# EAGLE design powermax (EAGLE 7.2.0)
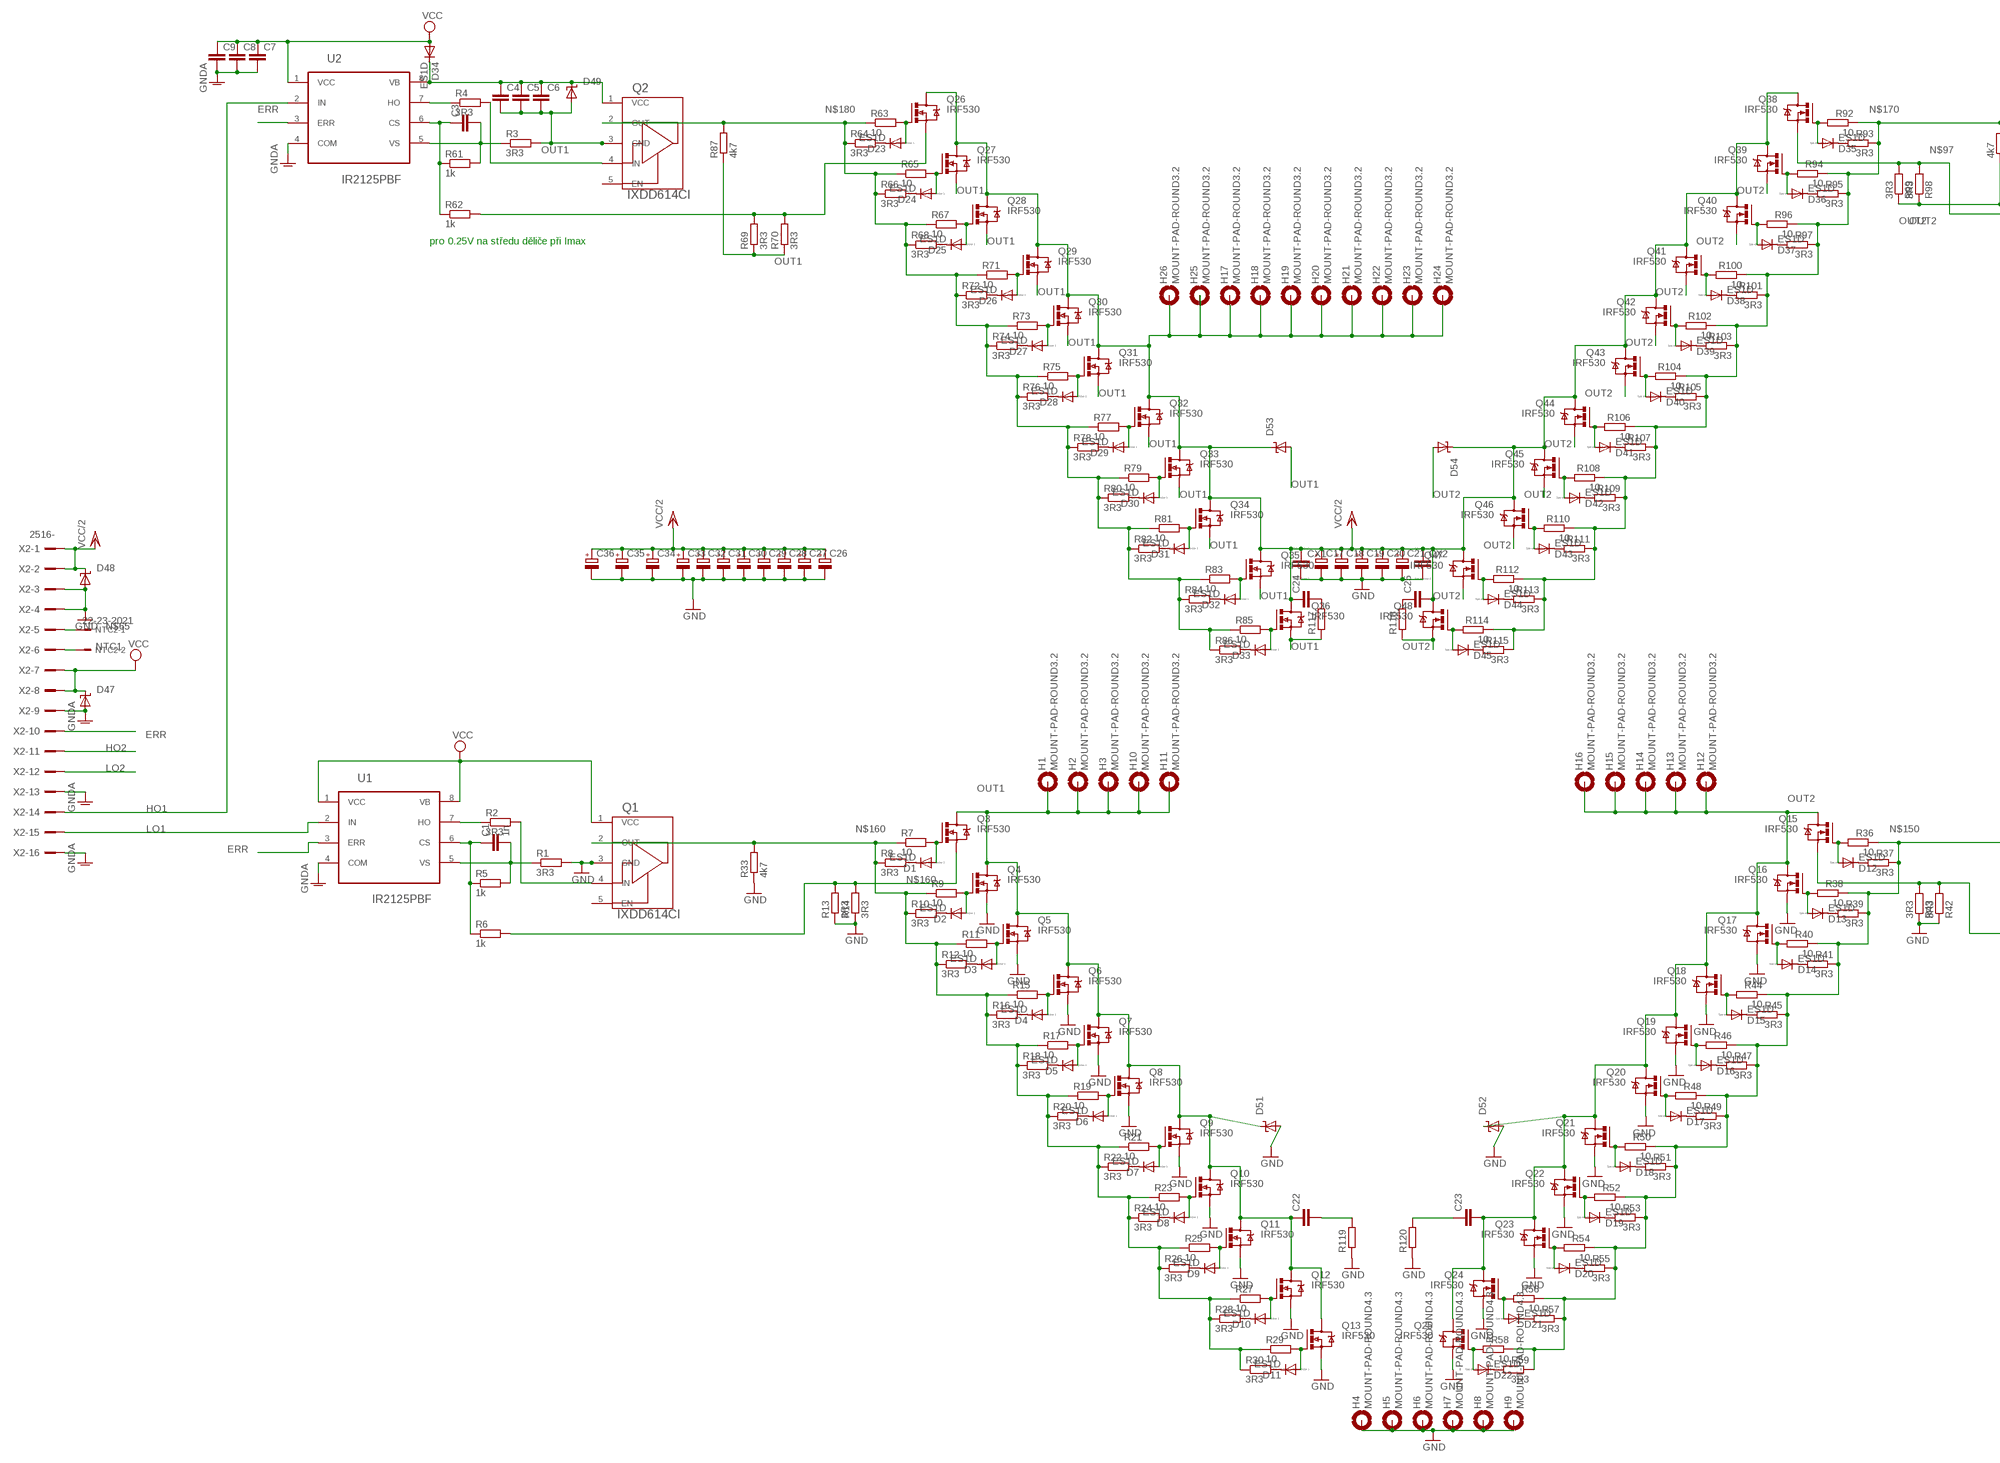
[diagram p0: schematic, sheet 1, part 1 of 2]
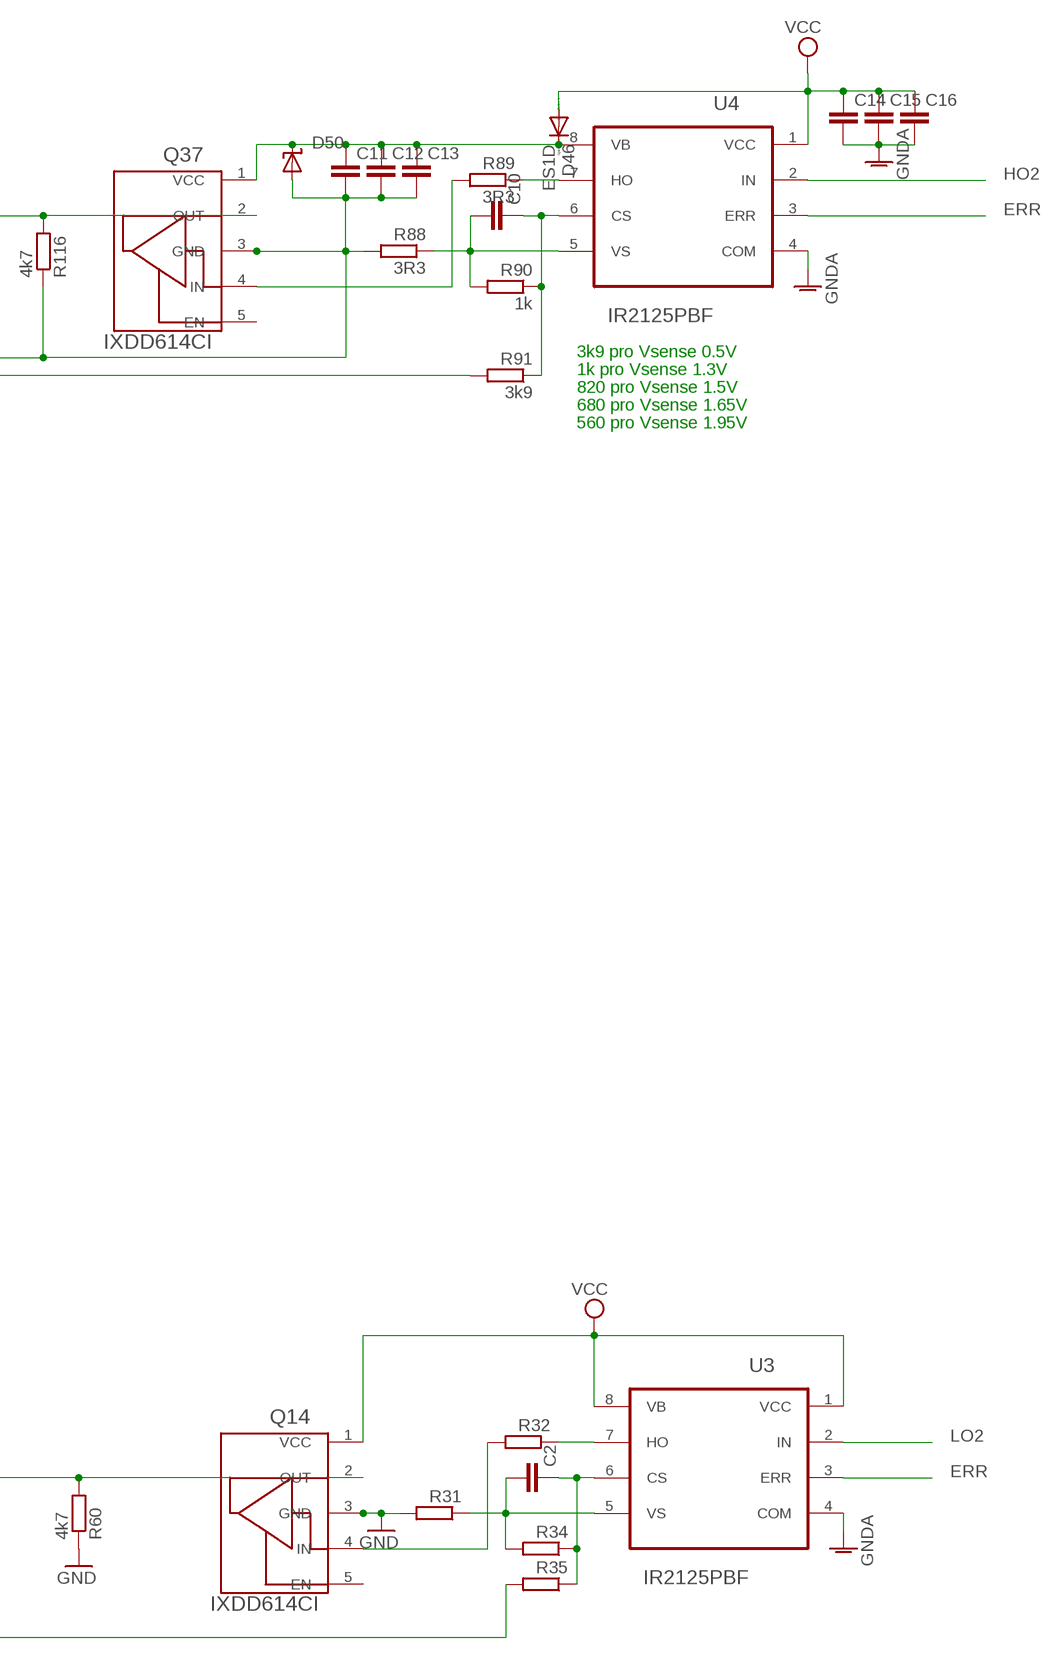
[diagram p1: schematic, sheet 1, part 2 of 2]

## Parts
C1  1n  C-EUC0805  [C0805]
C2  C-EUC0805  [C0805]
C3  C-EUC0805  [C0805]
C4  C-EUC1210  [C1210]
C5  C-EUC1210  [C1210]
C6  C-EUC1210  [C1210]
C7  C-EUC1210  [C1210]
C8  C-EUC1210  [C1210]
C9  C-EUC1210  [C1210]
C10  C-EUC0805  [C0805]
C11  C-EUC1210  [C1210]
C12  C-EUC1210  [C1210]
C13  C-EUC1210  [C1210]
C14  C-EUC1210  [C1210]
C15  C-EUC1210  [C1210]
C16  C-EUC1210  [C1210]
C17  CPOL-EUE10-35  [EB35D]
C18  CPOL-EUE10-35  [EB35D]
C19  CPOL-EUE10-35  [EB35D]
C20  CPOL-EUE10-35  [EB35D]
C21  CPOL-EUE10-35  [EB35D]
C22  C-EU225-113X268  [C225-113X268]
C23  C-EU225-113X268  [C225-113X268]
C24  C-EU225-113X268  [C225-113X268]
C25  C-EU225-113X268  [C225-113X268]
C26  CPOL-EUE7.5-18  [E7,5-18]
C27  CPOL-EUE7.5-18  [E7,5-18]
C28  CPOL-EUE7.5-18  [E7,5-18]
C29  CPOL-EUE7.5-18  [E7,5-18]
C30  CPOL-EUE7.5-18  [E7,5-18]
C31  CPOL-EUE7.5-18  [E7,5-18]
C32  CPOL-EUE7.5-18  [E7,5-18]
C33  CPOL-EUE7.5-18  [E7,5-18]
C34  CPOL-EUE7.5-18  [E7,5-18]
C35  CPOL-EUE7.5-18  [E7,5-18]
C36  CPOL-EUE7.5-18  [E7,5-18]
CX1  CXXC27B11  [XC27B11]
CX2  CXXC27B11  [XC27B11]
D1  ES1D  PMLL4150  [SOD80C]
D2  ES1D  PMLL4150  [SOD80C]
D3  ES1D  PMLL4150  [SOD80C]
D4  ES1D  PMLL4150  [SOD80C]
D5  ES1D  PMLL4150  [SOD80C]
D6  ES1D  PMLL4150  [SOD80C]
D7  ES1D  PMLL4150  [SOD80C]
D8  ES1D  PMLL4150  [SOD80C]
D9  ES1D  PMLL4150  [SOD80C]
D10  ES1D  PMLL4150  [SOD80C]
D11  ES1D  PMLL4150  [SOD80C]
D12  ES1D  PMLL4150  [SOD80C]
D13  ES1D  PMLL4150  [SOD80C]
D14  ES1D  PMLL4150  [SOD80C]
D15  ES1D  PMLL4150  [SOD80C]
D16  ES1D  PMLL4150  [SOD80C]
D17  ES1D  PMLL4150  [SOD80C]
D18  ES1D  PMLL4150  [SOD80C]
D19  ES1D  PMLL4150  [SOD80C]
D20  ES1D  PMLL4150  [SOD80C]
D21  ES1D  PMLL4150  [SOD80C]
D22  ES1D  PMLL4150  [SOD80C]
D23  ES1D  PMLL4150  [SOD80C]
D24  ES1D  PMLL4150  [SOD80C]
D25  ES1D  PMLL4150  [SOD80C]
D26  ES1D  PMLL4150  [SOD80C]
D27  ES1D  PMLL4150  [SOD80C]
D28  ES1D  PMLL4150  [SOD80C]
D29  ES1D  PMLL4150  [SOD80C]
D30  ES1D  PMLL4150  [SOD80C]
D31  ES1D  PMLL4150  [SOD80C]
D32  ES1D  PMLL4150  [SOD80C]
D33  ES1D  PMLL4150  [SOD80C]
D34  ES1D  PMLL4150  [SOD80C]
D35  ES1D  PMLL4150  [SOD80C]
D36  ES1D  PMLL4150  [SOD80C]
D37  ES1D  PMLL4150  [SOD80C]
D38  ES1D  PMLL4150  [SOD80C]
D39  ES1D  PMLL4150  [SOD80C]
D40  ES1D  PMLL4150  [SOD80C]
D41  ES1D  PMLL4150  [SOD80C]
D42  ES1D  PMLL4150  [SOD80C]
D43  ES1D  PMLL4150  [SOD80C]
D44  ES1D  PMLL4150  [SOD80C]
D45  ES1D  PMLL4150  [SOD80C]
D46  ES1D  PMLL4150  [SOD80C]
D47  SUPPRESSOR-SMBJ  [SMBJ]
D48  SUPPRESSOR-SMBJ  [SMBJ]
D49  SUPPRESSOR-SMBJ  [SMBJ]
D50  SUPPRESSOR-SMBJ  [SMBJ]
D51  SUPPRESSOR-SMBJ  [SMBJ]
D52  SUPPRESSOR-SMBJ  [SMBJ]
D53  SUPPRESSOR-SMBJ  [SMBJ]
D54  SUPPRESSOR-SMBJ  [SMBJ]
H1  MOUNT-PAD-ROUND3.2  [3,2-PAD]
H2  MOUNT-PAD-ROUND3.2  [3,2-PAD]
H3  MOUNT-PAD-ROUND3.2  [3,2-PAD]
H4  MOUNT-PAD-ROUND4.3  [4,3-PAD]
H5  MOUNT-PAD-ROUND4.3  [4,3-PAD]
H6  MOUNT-PAD-ROUND4.3  [4,3-PAD]
H7  MOUNT-PAD-ROUND4.3  [4,3-PAD]
H8  MOUNT-PAD-ROUND4.3  [4,3-PAD]
H9  MOUNT-PAD-ROUND4.3  [4,3-PAD]
H10  MOUNT-PAD-ROUND3.2  [3,2-PAD]
H11  MOUNT-PAD-ROUND3.2  [3,2-PAD]
H12  MOUNT-PAD-ROUND3.2  [3,2-PAD]
H13  MOUNT-PAD-ROUND3.2  [3,2-PAD]
H14  MOUNT-PAD-ROUND3.2  [3,2-PAD]
H15  MOUNT-PAD-ROUND3.2  [3,2-PAD]
H16  MOUNT-PAD-ROUND3.2  [3,2-PAD]
H17  MOUNT-PAD-ROUND3.2  [3,2-PAD]
H18  MOUNT-PAD-ROUND3.2  [3,2-PAD]
H19  MOUNT-PAD-ROUND3.2  [3,2-PAD]
H20  MOUNT-PAD-ROUND3.2  [3,2-PAD]
H21  MOUNT-PAD-ROUND3.2  [3,2-PAD]
H22  MOUNT-PAD-ROUND3.2  [3,2-PAD]
H23  MOUNT-PAD-ROUND3.2  [3,2-PAD]
H24  MOUNT-PAD-ROUND3.2  [3,2-PAD]
H25  MOUNT-PAD-ROUND3.2  [3,2-PAD]
H26  MOUNT-PAD-ROUND3.2  [3,2-PAD]
NTC2  22-23-2021  [22-23-2021]
Q1  IXDD614CI  [TO-220-5]
Q2  IXDD614CI  [TO-220-5]
Q3  IRF530  [TO220BV]
Q4  IRF530  [TO220BV]
Q5  IRF530  [TO220BV]
Q6  IRF530  [TO220BV]
Q7  IRF530  [TO220BV]
Q8  IRF530  [TO220BV]
Q9  IRF530  [TO220BV]
Q10  IRF530  [TO220BV]
Q11  IRF530  [TO220BV]
Q12  IRF530  [TO220BV]
Q13  IRF530  [TO220BV]
Q14  IXDD614CI  [TO-220-5]
Q15  IRF530  [TO220BV]
Q16  IRF530  [TO220BV]
Q17  IRF530  [TO220BV]
Q18  IRF530  [TO220BV]
Q19  IRF530  [TO220BV]
Q20  IRF530  [TO220BV]
Q21  IRF530  [TO220BV]
Q22  IRF530  [TO220BV]
Q23  IRF530  [TO220BV]
Q24  IRF530  [TO220BV]
Q25  IRF530  [TO220BV]
Q26  IRF530  [TO220BV]
Q27  IRF530  [TO220BV]
Q28  IRF530  [TO220BV]
Q29  IRF530  [TO220BV]
Q30  IRF530  [TO220BV]
Q31  IRF530  [TO220BV]
Q32  IRF530  [TO220BV]
Q33  IRF530  [TO220BV]
Q34  IRF530  [TO220BV]
Q35  IRF530  [TO220BV]
Q36  IRF530  [TO220BV]
Q37  IXDD614CI  [TO-220-5]
Q38  IRF530  [TO220BV]
Q39  IRF530  [TO220BV]
Q40  IRF530  [TO220BV]
Q41  IRF530  [TO220BV]
Q42  IRF530  [TO220BV]
Q43  IRF530  [TO220BV]
Q44  IRF530  [TO220BV]
Q45  IRF530  [TO220BV]
Q46  IRF530  [TO220BV]
Q47  IRF530  [TO220BV]
Q48  IRF530  [TO220BV]
R1  3R3  R-EU_R0805  [R0805]
R2  3R3  R-EU_R0805  [R0805]
R3  3R3  R-EU_R0805  [R0805]
R4  3R3  R-EU_R0805  [R0805]
R5  1k  R-EU_R0805  [R0805]
R6  1k  R-EU_R0805  [R0805]
R7  10  R-EU_R0805  [R0805]
R8  3R3  R-EU_R0805  [R0805]
R9  10  R-EU_R0805  [R0805]
R10  3R3  R-EU_R0805  [R0805]
R11  10  R-EU_R0805  [R0805]
R12  3R3  R-EU_R0805  [R0805]
R13  3R3  R-EU_R0805  [R0805]
R14  3R3  R-EU_R0805  [R0805]
R15  10  R-EU_R0805  [R0805]
R16  3R3  R-EU_R0805  [R0805]
R17  10  R-EU_R0805  [R0805]
R18  3R3  R-EU_R0805  [R0805]
R19  10  R-EU_R0805  [R0805]
R20  3R3  R-EU_R0805  [R0805]
R21  10  R-EU_R0805  [R0805]
R22  3R3  R-EU_R0805  [R0805]
R23  10  R-EU_R0805  [R0805]
R24  3R3  R-EU_R0805  [R0805]
R25  10  R-EU_R0805  [R0805]
R26  3R3  R-EU_R0805  [R0805]
R27  10  R-EU_R0805  [R0805]
R28  3R3  R-EU_R0805  [R0805]
R29  10  R-EU_R0805  [R0805]
R30  3R3  R-EU_R0805  [R0805]
R31  R-EU_R0805  [R0805]
R32  R-EU_R0805  [R0805]
R33  4k7  R-EU_R0805  [R0805]
R34  R-EU_R0805  [R0805]
R35  R-EU_R0805  [R0805]
R36  10  R-EU_R0805  [R0805]
R37  3R3  R-EU_R0805  [R0805]
R38  10  R-EU_R0805  [R0805]
R39  3R3  R-EU_R0805  [R0805]
R40  10  R-EU_R0805  [R0805]
R41  3R3  R-EU_R0805  [R0805]
R42  3R3  R-EU_R0805  [R0805]
R43  3R3  R-EU_R0805  [R0805]
R44  10  R-EU_R0805  [R0805]
R45  3R3  R-EU_R0805  [R0805]
R46  10  R-EU_R0805  [R0805]
R47  3R3  R-EU_R0805  [R0805]
R48  10  R-EU_R0805  [R0805]
R49  3R3  R-EU_R0805  [R0805]
R50  10  R-EU_R0805  [R0805]
R51  3R3  R-EU_R0805  [R0805]
R52  10  R-EU_R0805  [R0805]
R53  3R3  R-EU_R0805  [R0805]
R54  10  R-EU_R0805  [R0805]
R55  3R3  R-EU_R0805  [R0805]
R56  10  R-EU_R0805  [R0805]
R57  3R3  R-EU_R0805  [R0805]
R58  10  R-EU_R0805  [R0805]
R59  3R3  R-EU_R0805  [R0805]
R60  4k7  R-EU_R0805  [R0805]
R61  1k  R-EU_R0805  [R0805]
R62  1k  R-EU_R0805  [R0805]
R63  10  R-EU_R0805  [R0805]
R64  3R3  R-EU_R0805  [R0805]
R65  10  R-EU_R0805  [R0805]
R66  3R3  R-EU_R0805  [R0805]
R67  10  R-EU_R0805  [R0805]
R68  3R3  R-EU_R0805  [R0805]
R69  3R3  R-EU_R0805  [R0805]
R70  3R3  R-EU_R0805  [R0805]
R71  10  R-EU_R0805  [R0805]
R72  3R3  R-EU_R0805  [R0805]
R73  10  R-EU_R0805  [R0805]
R74  3R3  R-EU_R0805  [R0805]
R75  10  R-EU_R0805  [R0805]
R76  3R3  R-EU_R0805  [R0805]
R77  10  R-EU_R0805  [R0805]
R78  3R3  R-EU_R0805  [R0805]
R79  10  R-EU_R0805  [R0805]
R80  3R3  R-EU_R0805  [R0805]
R81  10  R-EU_R0805  [R0805]
R82  3R3  R-EU_R0805  [R0805]
R83  10  R-EU_R0805  [R0805]
R84  3R3  R-EU_R0805  [R0805]
R85  10  R-EU_R0805  [R0805]
R86  3R3  R-EU_R0805  [R0805]
R87  4k7  R-EU_R0805  [R0805]
R88  3R3  R-EU_R0805  [R0805]
R89  3R3  R-EU_R0805  [R0805]
R90  1k  R-EU_R0805  [R0805]
R91  3k9  R-EU_R0805  [R0805]
R92  10  R-EU_R0805  [R0805]
R93  3R3  R-EU_R0805  [R0805]
R94  10  R-EU_R0805  [R0805]
R95  3R3  R-EU_R0805  [R0805]
R96  10  R-EU_R0805  [R0805]
R97  3R3  R-EU_R0805  [R0805]
R98  3R3  R-EU_R0805  [R0805]
R99  3R3  R-EU_R0805  [R0805]
R100  10  R-EU_R0805  [R0805]
R101  3R3  R-EU_R0805  [R0805]
R102  10  R-EU_R0805  [R0805]
R103  3R3  R-EU_R0805  [R0805]
R104  10  R-EU_R0805  [R0805]
R105  3R3  R-EU_R0805  [R0805]
R106  10  R-EU_R0805  [R0805]
R107  3R3  R-EU_R0805  [R0805]
R108  10  R-EU_R0805  [R0805]
R109  3R3  R-EU_R0805  [R0805]
R110  10  R-EU_R0805  [R0805]
R111  3R3  R-EU_R0805  [R0805]
R112  10  R-EU_R0805  [R0805]
R113  3R3  R-EU_R0805  [R0805]
R114  10  R-EU_R0805  [R0805]
R115  3R3  R-EU_R0805  [R0805]
R116  4k7  R-EU_R0805  [R0805]
R117  R-EU_0411/15  [0411/15]
R118  R-EU_0411/15  [0411/15]
R119  R-EU_0411/15  [0411/15]
R120  R-EU_0411/15  [0411/15]
U1  IR2125PBF  [DIP254P762X533-8]
U2  IR2125PBF  [DIP254P762X533-8]
U3  IR2125PBF  [DIP254P762X533-8]
U4  IR2125PBF  [DIP254P762X533-8]
X2  2516-  [PAK100/2500-16]

## Nets
ERR: U1.3(ERR) U2.3(ERR) U3.3(ERR) U4.3(ERR) X2.10
GND: C17.- C18.- C19.- C20.- C21.- C26.- C27.- C28.- C29.- C30.- C31.- C32.- C33.- C34.- C35.- C36.- CX1.2 CX2.2 D48.A D51.A D52.A H4.B4,3(MOUNT) H5.B4,3(MOUNT) H6.B4,3(MOUNT) H7.B4,3(MOUNT) H8.B4,3(MOUNT) H9.B4,3(MOUNT) Q1.3(GND) Q4.S Q5.S Q6.S Q7.S Q8.S Q9.S Q10.S Q11.S Q12.S Q13.S Q14.3(GND) Q16.S Q17.S Q18.S Q19.S Q20.S Q21.S Q22.S Q23.S Q24.S Q25.S R1.2 R13.1 R14.1 R31.2 R33.1 R42.1 R43.1 R60.1 R119.1 R120.1 X2.3 X2.4
GNDA: C7.2 C8.2 C9.2 C14.2 C15.2 C16.2 D47.A U1.4(COM) U2.4(COM) U3.4(COM) U4.4(COM) X2.9 X2.13 X2.16
HO1: U2.2(IN) X2.14
HO2: U4.2(IN) X2.11
LO1: U1.2(IN) X2.15
LO2: U3.2(IN) X2.12
N$1: C1.2 R1.1 R5.2 U1.5(VS)
N$2: Q1.4(IN) R2.2
N$3: R2.1 U1.7(HO)
N$4: C2.2 R31.1 R34.2 U3.5(VS)
N$5: D2.A Q4.G R9.2
N$6: C1.1 R5.1 R6.1 U1.6(CS)
N$7: D1.A Q3.G R7.2
N$8: D1.C R8.2
N$9: D2.C R10.2
N$10: Q14.4(IN) R32.2
N$11: R32.1 U3.7(HO)
N$12: C4.1 C5.1 C6.1 D34.C D49.C Q2.1(VCC) U2.8(VB)
N$13: D3.A Q5.G R11.2
N$14: D3.C R12.2
N$15: C2.1 R34.1 R35.1 U3.6(CS)
N$16: Q3.S R6.2 R13.2 R14.2
N$17: D12.A Q15.G R36.2
N$18: D12.C R37.2
N$19: D4.A Q6.G R15.2
N$20: D4.C R16.2
N$21: D5.A Q7.G R17.2
N$22: D5.C R18.2
N$23: D13.A Q16.G R38.2
N$24: D6.A Q8.G R19.2
N$25: D6.C R20.2
N$26: D13.C R39.2
N$27: D7.A Q9.G R21.2
N$28: D7.C R22.2
N$29: D8.A Q10.G R23.2
N$30: D8.C R24.2
N$32: D9.A Q11.G R25.2
N$33: D9.C R26.2
N$34: D14.A Q17.G R40.2
N$35: D10.A Q12.G R27.2
N$36: D10.C R28.2
N$37: D11.A Q13.G R29.2
N$38: D11.C R30.2
N$39: D14.C R41.2
N$40: Q15.S R35.2 R42.2 R43.2
N$41: D15.A Q18.G R44.2
N$42: D15.C R45.2
N$43: D16.A Q19.G R46.2
N$44: D16.C R47.2
N$45: D17.A Q20.G R48.2
N$46: D17.C R49.2
N$47: D18.A Q21.G R50.2
N$48: D18.C R51.2
N$49: D19.A Q22.G R52.2
N$50: D19.C R53.2
N$51: D20.A Q23.G R54.2
N$52: D20.C R55.2
N$53: D21.A Q24.G R56.2
N$54: D21.C R57.2
N$55: D22.A Q25.G R58.2
N$56: D22.C R59.2
N$57: C3.2 R3.1 R61.2 U2.5(VS)
N$58: Q2.4(IN) R4.2
N$59: R4.1 U2.7(HO)
N$60: C3.1 R61.1 R62.1 U2.6(CS)
N$61: D23.A Q26.G R63.2
N$62: D23.C R64.2
N$63: D24.A Q27.G R65.2
N$64: D24.C R66.2
N$65: NTC2.1 X2.5
N$66: D25.A Q28.G R67.2
N$67: D25.C R68.2
N$68: Q26.S R62.2 R69.2 R70.2
N$69: D26.A Q29.G R71.2
N$70: D26.C R72.2
N$71: D27.A Q30.G R73.2
N$72: D27.C R74.2
N$73: D28.A Q31.G R75.2
N$74: D28.C R76.2
N$75: D29.A Q32.G R77.2
N$76: D29.C R78.2
N$77: D30.A Q33.G R79.2
N$78: D30.C R80.2
N$79: D31.A Q34.G R81.2
N$80: D31.C R82.2
N$81: D32.A Q35.G R83.2
N$82: D32.C R84.2
N$83: D33.A Q36.G R85.2
N$84: D33.C R86.2
N$86: C10.2 R88.1 R90.2 U4.5(VS)
N$87: Q37.4(IN) R89.2
N$88: R89.1 U4.7(HO)
N$89: C10.1 R90.1 R91.1 U4.6(CS)
N$90: D35.A Q38.G R92.2
N$91: D35.C R93.2
N$92: D36.A Q39.G R94.2
N$93: D36.C R95.2
N$95: D37.A Q40.G R96.2
N$96: D37.C R97.2
N$97: Q38.S R91.2 R98.2 R99.2
N$98: D38.A Q41.G R100.2
N$99: D38.C R101.2
N$100: D39.A Q42.G R102.2
N$101: D39.C R103.2
N$102: D40.A Q43.G R104.2
N$103: D40.C R105.2
N$104: D41.A Q44.G R106.2
N$105: D41.C R107.2
N$106: D42.A Q45.G R108.2
N$107: D42.C R109.2
N$108: D43.A Q46.G R110.2
N$109: D43.C R111.2
N$110: D44.A Q47.G R112.2
N$111: D44.C R113.2
N$112: D45.A Q48.G R114.2
N$113: D45.C R115.2
N$115: C11.1 C12.1 C13.1 D46.C D50.C Q37.1(VCC) U4.8(VB)
N$118: C24.2 R117.2
N$119: C25.1 R118.2
N$120: C22.2 R119.2
N$121: C23.1 R120.2
N$150: Q14.2(OUT) R36.1 R37.1 R38.1 R39.1 R40.1 R41.1 R44.1 R45.1 R46.1 R47.1 R48.1 R49.1 R50.1 R51.1 R52.1 R53.1 R54.1 R55.1 R56.1 R57.1 R58.1 R59.1 R60.2
N$160: Q1.2(OUT) R7.1 R8.1 R9.1 R10.1 R11.1 R12.1 R15.1 R16.1 R17.1 R18.1 R19.1 R20.1 R21.1 R22.1 R23.1 R24.1 R25.1 R26.1 R27.1 R28.1 R29.1 R30.1 R33.2
N$170: Q37.2(OUT) R92.1 R93.1 R94.1 R95.1 R96.1 R97.1 R100.1 R101.1 R102.1 R103.1 R104.1 R105.1 R106.1 R107.1 R108.1 R109.1 R110.1 R111.1 R112.1 R113.1 R114.1 R115.1 R116.2
N$180: Q2.2(OUT) R63.1 R64.1 R65.1 R66.1 R67.1 R68.1 R71.1 R72.1 R73.1 R74.1 R75.1 R76.1 R77.1 R78.1 R79.1 R80.1 R81.1 R82.1 R83.1 R84.1 R85.1 R86.1 R87.2
NTC1: NTC2.2 X2.6
OUT1: C4.2 C5.2 C6.2 C22.1 D49.A D51.C D53.A H1.B3,2(MOUNT) H2.B3,2(MOUNT) H3.B3,2(MOUNT) H10.B3,2(MOUNT) H11.B3,2(MOUNT) Q2.3(GND) Q3.D Q4.D Q5.D Q6.D Q7.D Q8.D Q9.D Q10.D Q11.D Q12.D Q13.D Q27.S Q28.S Q29.S Q30.S Q31.S Q32.S Q33.S Q34.S Q35.S Q36.S R3.2 R69.1 R70.1 R87.1 R117.1
OUT2: C11.2 C12.2 C13.2 C23.2 D50.A D52.C D54.A H12.B3,2(MOUNT) H13.B3,2(MOUNT) H14.B3,2(MOUNT) H15.B3,2(MOUNT) H16.B3,2(MOUNT) Q15.D Q16.D Q17.D Q18.D Q19.D Q20.D Q21.D Q22.D Q23.D Q24.D Q25.D Q37.3(GND) Q39.S Q40.S Q41.S Q42.S Q43.S Q44.S Q45.S Q46.S Q47.S Q48.S R88.2 R98.1 R99.1 R116.1 R118.1
VCC: C7.1 C8.1 C9.1 C14.1 C15.1 C16.1 D34.A D46.A D47.C Q1.1(VCC) Q14.1(VCC) U1.1(VCC) U1.8(VB) U2.1(VCC) U3.1(VCC) U3.8(VB) U4.1(VCC) X2.7 X2.8
VCC/2: C17.+ C18.+ C19.+ C20.+ C21.+ C24.1 C25.2 C26.+ C27.+ C28.+ C29.+ C30.+ C31.+ C32.+ C33.+ C34.+ C35.+ C36.+ CX1.1 CX2.1 D48.C D53.C D54.C H17.B3,2(MOUNT) H18.B3,2(MOUNT) H19.B3,2(MOUNT) H20.B3,2(MOUNT) H21.B3,2(MOUNT) H22.B3,2(MOUNT) H23.B3,2(MOUNT) H24.B3,2(MOUNT) H26.B3,2(MOUNT) Q26.D Q27.D Q28.D Q29.D Q30.D Q31.D Q32.D Q33.D Q34.D Q35.D Q36.D Q38.D Q39.D Q40.D Q41.D Q42.D Q43.D Q44.D Q45.D Q46.D Q47.D Q48.D X2.1 X2.2
Unconnected: H25.B3,2(MOUNT) Q1.5(EN) Q2.5(EN) Q14.5(EN) Q37.5(EN)

## Notes on the sheet
- 3k9 pro Vsense 0.5V
- 1k pro Vsense 1.3V
- 820 pro Vsense 1.5V
- 680 pro Vsense 1.65V
- pro 0.25V na středu děliče při Imax | 560 pro Vsense 1.95V

## Library data of the parts
C1-C16 C22-C25 = resistor:C-EU: CAPACITOR, European symbol
C17-C21 C26-C36 = resistor:CPOL-EU: POLARIZED CAPACITOR, European symbol
CX1 CX2 = resistor:CX: X CAPACITOR for power line
D1-D46 = diode:PMLL4150: DIODE high speed
D47-D54 = diode:SUPPRESSOR-: Suppressor diode
H1-H26 = holes:MOUNT-PAD-ROUND: MOUNTING PAD, round
NTC2 = con-molex:22-23-2021: .100" (2.54mm) Center Header - 2 Pin; MF: MOLEX; MPN: 22-23-2021; OC_FARNELL: 1462926; OC_NEWARK: 25C3832
Q1 Q2 Q14 Q37 = IXDD614CI:IXDD614CI: MOSFET N-CH 14A LO SIDE TO-220-5; AVAILABILITY: Unavailable; DESCRIPTION: Low-Side Gate Driver IC Non-Inverting TO-220-5; MF: IXYS Integrated; MP: IXDD614CI; PACKAGE: TO-220 IXYS; PRICE: None
Q3-Q13 Q15-Q36 Q38-Q48 = transistor-power:IRF530: HEXFET Power MOSFET
R1-R120 = resistor:R-EU_: RESISTOR, European symbol
U1-U4 = ir21xx:IR2125PBF: SINGLE CHANNEL DRIVER; MPN: IR2125PBF; OC_FARNELL: 9101721; OC_NEWARK: 19K8423; PACKAGE: PDIP; SUPPLIER: INTERNATIONAL RECTIFIER
X2 = con-3m:2516-: 3M (TM) Pak 100 4-Wall Header Source: 3M; OC_FARNELL: unknown; OC_NEWARK: unknown

## Board
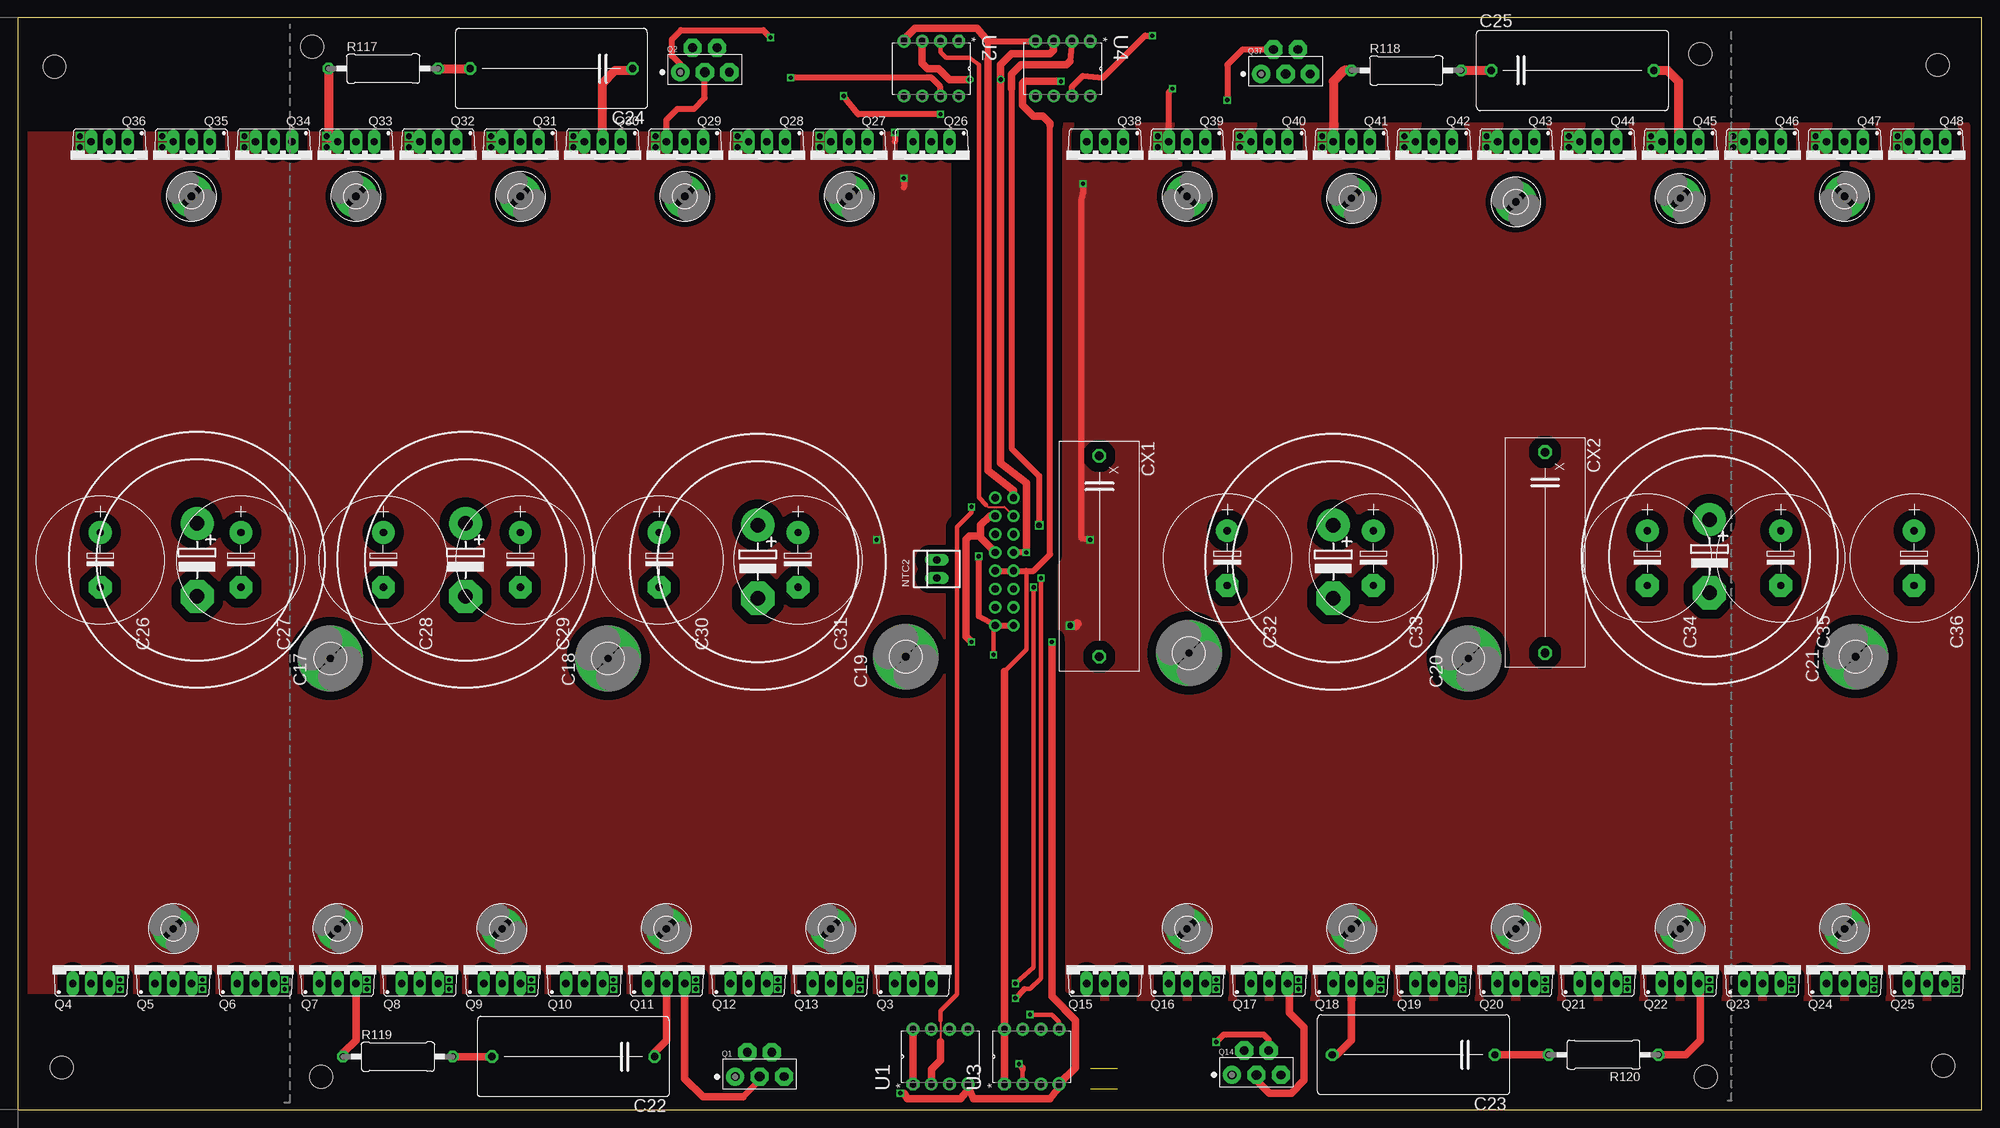
[diagram p2: board, top side]
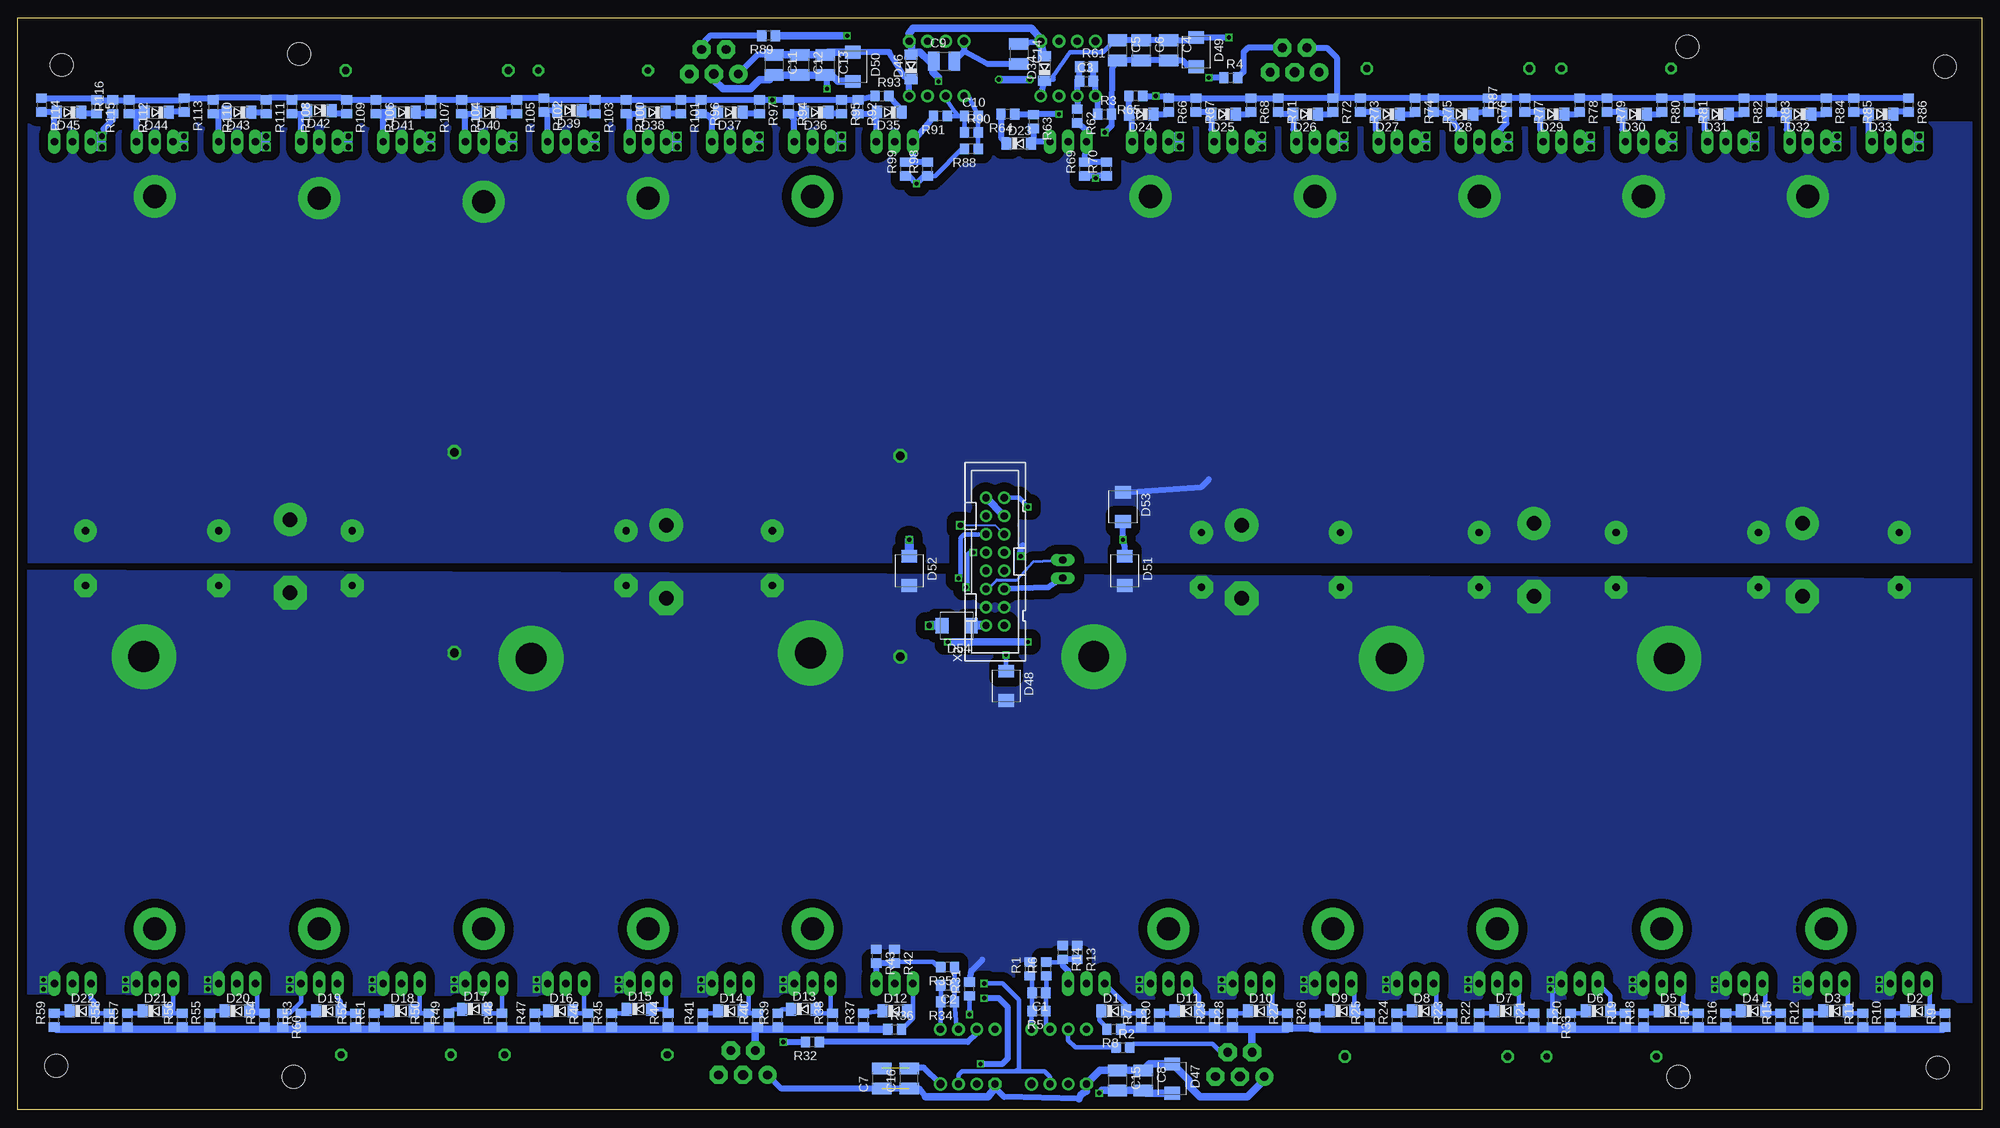
[diagram p3: board, bottom side, seen from below]

Size 273.03 x 151.82 mm. Coordinates in mm from the lower left corner, seen from the top.
Outline: 0,0 273.03,0 273.03,151.82 0,151.82 0,0
Copper layers (1*16): Top 0.035mm / dielectric 1.5mm / Bottom 0.035mm
Design rules "2 vrstvy trida 6 *": minimum track width 0.15mm, minimum drill 0.3mm, track to track 0.15mm, track to pad 0.15mm, pad to pad 0.15mm, via to via 0.15mm, smd to smd 0.15mm, copper to edge 1mm, drill to drill 0.3mm, minimum pad ring 0.35mm, minimum via ring 0.2mm, stop-mask expansion 0.05mm, vias tented up to drill 3mm, thermal gap 10mil
Holes 3.2 mm at 40.89,147.83 5.08,145.03 233.93,146.81 266.95,145.29 267.72,6.1 234.7,4.57 42.16,4.57 6.1,5.84

### Footprints (pad centres in the part's own frame; a part is rotated, then mirrored left to right if it is on the bottom)
C0805 = smd 1.3 x 1.5: 1 -0.95,0; 2 0.95,0
C1210 = smd 1.6 x 2.7: 1 -1.4,0; 2 1.4,0
EB35D = drill 2.007 pad 4.597: + -5.08,0 | drill 2.007 pad 4.597 octagon: - 5.08,0
C225-113X268 = drill 1.016 octagon: 1 -11.303,0; 2 11.303,0
E7,5-18 = drill 1.016 pad 3.15: + -3.81,0 | drill 1.016 pad 3.15 octagon: - 3.81,0
XC27B11 = drill 1.194 octagon: 1 -13.97,0; 2 13.97,0
SOD80C = smd 1.4 x 1.8: A 1.7,0; C -1.7,0
SMBJ = smd 1.78 x 2.16: A 2.04,0; C -2.03,0
3,2-PAD = drill 3.2 pad 5.842: B3,2 0,0
4,3-PAD = drill 4.3 pad 9: B4,3 0,0
22-23-2021 = drill 1 long: 1 -1.27,0; 2 1.27,0
TO-220-5 = drill 1.2 pad 2.54: 1 -3.404,0 | drill 1.2 pad 2.54 octagon: 2 -1.702,3.4; 4 1.702,3.4; 5 3.404,0 | drill 1.34 pad 2.54 octagon: 3 0,0
TO220BV = drill 1.016 long: D 0,-2.54; G -2.54,-2.54; S 2.54,-2.54
R0805 = smd 1.3 x 1.5: 1 -0.95,0; 2 0.95,0
0411/15 = drill 0.914 octagon: 1 -7.62,0; 2 7.62,0
DIP254P762X533-8 = drill 1 pad 1.778 octagon: 1 -7.62,7.62 | drill 1 pad 1.778: 2 -7.62,5.08; 3 -7.62,2.54; 5 0,0; 6 0,2.54; 7 0,5.08; 8 0,7.62 | drill 1.118: 4 -7.62,0
PAK100/2500-16 = drill 1 pad 1.422: 1 -8.89,-1.27; 2 -8.89,1.27; 3 -6.35,-1.27; 4 -6.35,1.27; 5 -3.81,-1.27; 6 -3.81,1.27; 7 -1.27,-1.27; 8 -1.27,1.27; 9 1.27,-1.27; 10 1.27,1.27; 11 3.81,-1.27; 12 3.81,1.27; 13 6.35,-1.27; 14 6.35,1.27; 15 8.89,-1.27; 16 8.89,1.27

### Placement (x,y rotation side)
C1  131.06,16.26 180 bottom
C2  143.76,17.27 180 bottom
C3  124.46,143 0 bottom
C4  113.03,147.32 270 bottom
C5  120.14,147.32 270 bottom
C6  116.84,147.32 270 bottom
C7  152.91,4.32 90 bottom
C8  116.59,4.06 270 bottom
C9  144.27,145.8 0 bottom
C10  140.46,138.18 0 bottom
C11  167.89,145.29 270 bottom
C12  164.34,145.29 270 bottom
C13  160.78,145.29 270 bottom
C14  133.86,146.81 270 bottom
C15  120.14,4.06 270 bottom
C16  149.1,4.32 90 bottom
C17  24.89,76.45 270 top
C18  62.23,76.45 270 top
C19  102.87,76.2 270 top
C20  182.88,76.2 270 top
C21  235.2,76.96 270 top
C22  77.22,7.37 180 top
C23  194.06,7.62 180 top
C24  74.17,144.78 180 top
C25  216.15,144.53 0 top
C26  11.43,76.45 270 top
C27  30.99,76.45 270 top
C28  50.8,76.45 270 top
C29  69.85,76.45 270 top
C30  89.15,76.45 270 top
C31  108.46,76.45 270 top
C32  168.15,76.71 270 top
C33  188.47,76.71 270 top
C34  226.57,76.71 270 top
C35  245.11,76.71 270 top
C36  263.65,76.71 270 top
CX1  150.37,76.96 270 top
CX2  212.34,77.47 270 top
D1  120.65,13.72 0 bottom
D2  8.89,13.72 0 bottom
D3  20.32,13.72 0 bottom
D4  31.75,13.72 0 bottom
D5  43.18,13.72 0 bottom
D6  53.34,13.72 0 bottom
D7  66.04,13.72 0 bottom
D8  77.47,13.72 0 bottom
D9  88.9,13.72 0 bottom
D10  100.33,13.72 0 bottom
D11  110.49,13.72 0 bottom
D12  151.13,13.72 0 bottom
D13  163.83,13.97 0 bottom
D14  173.99,13.72 0 bottom
D15  186.69,13.97 0 bottom
D16  197.61,13.72 0 bottom
D17  209.55,13.97 0 bottom
D18  219.71,13.72 0 bottom
D19  229.87,13.72 0 bottom
D20  242.57,13.72 0 bottom
D21  254,13.72 0 bottom
D22  264.16,13.72 0 bottom
D23  133.86,134.37 0 bottom
D24  116.84,138.43 180 bottom
D25  105.41,138.43 180 bottom
D26  93.98,138.43 180 bottom
D27  82.55,138.43 180 bottom
D28  72.39,138.43 180 bottom
D29  59.69,138.43 180 bottom
D30  48.26,138.43 180 bottom
D31  36.83,138.43 180 bottom
D32  25.4,138.43 180 bottom
D33  13.97,138.43 180 bottom
D34  130.3,144.78 90 bottom
D35  151.89,138.68 180 bottom
D36  162.05,138.68 180 bottom
D37  173.99,138.68 180 bottom
D38  184.66,138.68 180 bottom
D39  196.34,138.94 180 bottom
D40  207.52,138.68 180 bottom
D41  219.46,138.68 180 bottom
D42  231.14,138.94 180 bottom
D43  242.32,138.68 180 bottom
D44  253.75,138.68 180 bottom
D45  265.94,138.68 180 bottom
D46  148.84,145.03 90 bottom
D47  112.52,4.32 270 bottom
D48  135.64,58.93 270 bottom
D49  109.22,147.07 270 bottom
D50  156.97,145.03 270 bottom
D51  119.13,74.93 270 bottom
D52  149.1,74.93 270 bottom
D53  119.38,83.82 270 bottom
D54  142.49,67.31 180 bottom
H1  90.17,25.15 90 top
H2  113.03,25.15 90 top
H3  67.31,25.15 90 top
H4  123.44,62.99 90 top
H5  201.68,62.74 90 top
H6  162.81,63.5 90 top
H7  255.52,62.99 90 top
H8  82.04,62.74 90 top
H9  43.43,62.74 90 top
H10  44.45,25.15 90 top
H11  21.59,25.15 90 top
H12  231.14,25.15 90 top
H13  254,25.15 90 top
H14  208.28,25.15 90 top
H15  185.42,25.15 90 top
H16  162.56,25.15 90 top
H17  24.13,127 90 top
H18  46.99,127 90 top
H19  69.85,127 90 top
H20  92.71,127 90 top
H21  115.57,127 90 top
H22  231.14,126.75 90 top
H23  185.42,126.75 90 top
H24  208.28,126.24 90 top
H25  162.56,127 0 top
H26  254,127 0 top
NTC2  127.76,75.18 90 top
Q1  103.12,4.57 0 top
Q2  95.5,144.27 0 top
Q3  124.46,20.07 0 top
Q4  10.16,20.07 0 top
Q5  21.59,20.07 0 top
Q6  33.02,20.07 0 top
Q7  44.45,20.07 0 top
Q8  55.88,20.07 0 top
Q9  67.31,20.07 0 top
Q10  78.74,20.07 0 top
Q11  90.17,20.07 0 top
Q12  101.6,20.07 0 top
Q13  113.03,20.07 0 top
Q14  172.21,4.83 0 top
Q15  151.13,20.07 0 top
Q16  162.56,20.07 0 top
Q17  173.99,20.07 0 top
Q18  185.42,20.07 0 top
Q19  196.85,20.07 0 top
Q20  208.28,20.07 0 top
Q21  219.71,20.07 0 top
Q22  231.14,20.07 0 top
Q23  242.57,20.07 0 top
Q24  254,20.07 0 top
Q25  265.43,20.07 0 top
Q26  127,132.08 180 top
Q27  115.57,132.08 180 top
Q28  104.14,132.08 180 top
Q29  92.71,132.08 180 top
Q30  81.28,132.08 180 top
Q31  69.85,132.08 180 top
Q32  58.42,132.08 180 top
Q33  46.99,132.08 180 top
Q34  35.56,132.08 180 top
Q35  24.13,132.08 180 top
Q36  12.7,132.08 180 top
Q37  176.28,144.02 0 top
Q38  151.13,132.08 180 top
Q39  162.56,132.08 180 top
Q40  173.99,132.08 180 top
Q41  185.42,132.08 180 top
Q42  196.85,132.08 180 top
Q43  208.28,132.08 180 top
Q44  219.71,132.08 180 top
Q45  231.14,132.08 180 top
Q46  242.57,132.08 180 top
Q47  254,132.08 180 top
Q48  265.43,132.08 180 top
R1  132.33,19.56 90 bottom
R2  119.38,8.64 0 bottom
R3  121.92,138.43 0 bottom
R4  104.39,143.51 0 bottom
R5  131.06,13.72 180 bottom
R6  130.05,19.56 90 bottom
R7  116.84,12.45 90 bottom
R8  120.65,11.18 180 bottom
R9  5.08,12.45 90 bottom
R10  12.7,12.45 90 bottom
R11  16.51,12.45 90 bottom
R12  24.13,12.45 90 bottom
R13  125.73,21.84 270 bottom
R14  127.76,21.84 270 bottom
R15  27.94,12.45 90 bottom
R16  35.56,12.45 90 bottom
R17  39.37,12.45 90 bottom
R18  46.99,12.45 90 bottom
R19  49.53,12.45 90 bottom
R20  57.15,12.45 90 bottom
R21  62.23,12.45 90 bottom
R22  69.85,12.45 90 bottom
R23  73.66,12.45 90 bottom
R24  81.28,12.45 90 bottom
R25  85.09,12.45 90 bottom
R26  92.71,12.45 90 bottom
R27  96.52,12.45 90 bottom
R28  104.14,12.45 90 bottom
R29  106.68,12.45 90 bottom
R30  114.3,12.45 90 bottom
R31  140.72,16.76 90 bottom
R32  162.56,9.4 180 bottom
R33  59.69,12.45 270 bottom
R34  143.76,14.99 180 bottom
R35  143.76,19.81 180 bottom
R36  151.13,11.18 0 bottom
R37  155.45,12.45 90 bottom
R38  159.77,12.45 90 bottom
R39  167.39,12.45 90 bottom
R40  170.18,12.45 90 bottom
R41  177.8,12.45 90 bottom
R42  151.13,21.34 270 bottom
R43  153.67,21.34 270 bottom
R44  182.63,12.45 90 bottom
R45  190.5,12.45 90 bottom
R46  193.8,12.45 90 bottom
R47  201.17,12.45 90 bottom
R48  205.74,12.45 90 bottom
R49  213.11,12.45 90 bottom
R50  215.9,12.45 90 bottom
R51  223.52,12.45 90 bottom
R52  226.06,12.45 90 bottom
R53  233.68,12.45 90 bottom
R54  238.76,12.45 90 bottom
R55  246.38,12.45 90 bottom
R56  250.19,12.45 90 bottom
R57  257.81,12.45 90 bottom
R58  260.35,12.45 90 bottom
R59  267.97,12.45 90 bottom
R60  236.22,12.45 270 bottom
R61  124.46,145.03 0 bottom
R62  125.73,138.18 270 bottom
R63  131.83,137.41 270 bottom
R64  135.38,138.43 180 bottom
R65  117.6,140.97 180 bottom
R66  113.03,139.7 270 bottom
R67  109.22,139.7 270 bottom
R68  101.6,139.7 270 bottom
R69  124.71,130.81 90 bottom
R70  121.67,130.81 90 bottom
R71  97.79,139.7 270 bottom
R72  90.17,139.7 270 bottom
R73  86.36,139.7 270 bottom
R74  78.74,139.7 270 bottom
R75  76.2,139.7 270 bottom
R76  68.58,139.7 270 bottom
R77  63.5,139.7 270 bottom
R78  55.88,139.7 270 bottom
R79  52.07,139.7 270 bottom
R80  44.45,139.7 270 bottom
R81  40.64,139.7 270 bottom
R82  33.02,139.7 270 bottom
R83  29.21,139.7 270 bottom
R84  21.59,139.7 270 bottom
R85  17.78,139.7 270 bottom
R86  10.16,139.7 270 bottom
R87  66.04,139.7 90 bottom
R88  140.46,133.6 180 bottom
R89  168.66,149.35 180 bottom
R90  140.46,135.89 0 bottom
R91  144.78,138.18 180 bottom
R92  156.21,139.45 270 bottom
R93  152.91,140.97 0 bottom
R94  165.86,139.45 270 bottom
R95  158.5,139.45 270 bottom
R96  178.05,139.45 270 bottom
R97  169.93,139.45 270 bottom
R98  146.56,130.81 90 bottom
R99  149.61,130.81 90 bottom
R100  188.47,139.45 270 bottom
R101  180.85,139.45 270 bottom
R102  199.9,139.7 270 bottom
R103  192.79,139.45 270 bottom
R104  211.33,139.45 270 bottom
R105  203.71,139.45 270 bottom
R106  223.27,139.45 270 bottom
R107  215.65,139.45 270 bottom
R108  234.95,139.45 270 bottom
R109  227.33,139.45 270 bottom
R110  245.87,139.45 270 bottom
R111  238.51,139.45 270 bottom
R112  257.56,139.45 270 bottom
R113  249.94,139.7 270 bottom
R114  269.75,139.7 270 bottom
R115  262.13,139.45 270 bottom
R116  259.84,139.45 90 bottom
R117  50.8,144.78 0 top
R118  193.04,144.53 0 top
R119  52.83,7.37 0 top
R120  220.47,7.62 180 top
U1  132.08,11.18 90 top
U2  123.19,140.97 270 top
U3  144.78,11.18 90 top
U4  141.48,140.97 270 top
X2  137.16,76.2 90 bottom

### Tracks (layer width: path | path; a pad name or v marks a point on that pad's centre or on a via)
ERR  (via drill 0.6)
  Top 0.61: v141.22,72.64 141.22,19.81 v138.68,17.53
  Top 0.813: 140.21,78.23 v140.21,77.47 X2.10
  Top 1.016: 140.21,78.23 140.21,87.12 136.65,89.92 v136.65,143.26 136.65,145.29 138.18,146.81 143.51,146.81 144.02,147.32 U4.3 | v132.33,143.26 129.54,143.26 128.02,144.78 126.49,144.78 125.73,145.54 U2.3
  Bottom 0.61: U3.3 142.24,4.83 141.73,5.33 134.37,5.33 | 134.37,5.33 130.3,5.33 129.54,4.57 U1.3 | v140.21,77.47 140.72,77.47 140.97,77.22 140.97,72.9 v141.22,72.64 | v138.68,17.53 136.14,17.53 133.86,15.24 133.86,5.59 134.37,5.33
  Bottom 1.016: v132.33,143.26 v136.65,143.26
GND  (via drill 0.6)
  Top 0.813: Q14.3 172.21,4.06 | 176.78,17.27 Q17.S | Q1.3 103.12,4.06 100.84,1.78 | R119.1 45.21,7.87
  Top 1.016: 172.21,4.06 173.99,2.29 177.04,2.29 178.82,4.06 178.82,11.43 176.78,13.46 176.78,17.27 | 100.84,1.78 95.25,1.78 92.71,4.32 Q11.S | 45.21,7.87 46.99,9.65 Q7.S | R120.1 231.9,7.62 233.93,9.65 233.93,17.27 Q22.S
  Bottom 0.61: R60.1 235.27,13.4 233.68,14.99 Q22.S | R33.1 59.69,16.26 Q8.S
  Bottom 0.813: R31.2 140.46,19.3 138.94,20.83
  other vias: 71.37,16.76 71.37,18.03 82.8,16.76 82.8,18.03 94.23,18.03 94.23,16.76 105.66,16.76 105.66,18.03 59.94,16.76 59.94,18.03 48.51,16.76 48.51,18.03 37.08,16.76 37.08,18.03 25.65,16.76 25.65,18.03 14.22,16.76 14.22,18.03 117.09,16.76 117.09,18.03 166.62,16.76 166.62,18.03 178.05,16.76 178.05,18.03 178.05,16.76 189.48,16.76 189.48,18.03 200.91,16.76 200.91,18.03 212.34,16.76 212.34,18.03 223.77,16.76 223.77,18.03 235.2,16.76 235.2,18.03 246.63,16.76 246.63,18.03 258.06,16.76 258.06,18.03 269.49,16.76 269.49,16.76 269.49,18.03
  pour Bottom (isolate 1.27, no thermals): 1.27,73.66 273.05,74.93 273.05,16.26 1.27,14.99
GNDA  (via drill 0.6)  (1 unrouted)
  Top 0.61: 133.86,80.01 133.6,79.76
  Top 0.813: 134.87,146.05 134.87,148.59 U4.4 | U2.4 123.19,148.84 | U1.4 132.08,3.05 132.21,2.92 | 144.53,2.79 144.53,3.3 U3.4
  Top 1.016: X2.16 138.43,86.11 134.87,88.9 134.87,146.05 | 123.19,148.84 124.71,150.37 133.35,150.37 134.87,148.59 | 144.53,2.79 143.51,1.52 132.84,1.52 132.21,2.92 131.06,1.52 123.7,1.52 123.19,2.29 v122.68,2.29 | X2.9 133.6,79.76 132.33,79.76 131.83,79.25 131.83,65.79 v132.59,65.02 | v143.76,65.02 143.76,15.75 147.07,12.45 147.07,5.84 U3.4 | X2.13 135.13,82.55 133.86,81.28 133.86,80.01
  Bottom 0.813: U4.4 141.48,147.19 | 141.48,147.19 C9.2 | C14.2 138.18,145.41 141.48,147.19 | U3.4 147.07,5.84 148.97,5.84 C16.2
  Bottom 1.016: X2.13 X2.16 | v132.59,65.02 v143.76,65.02 | D47.A 116.2,2.28 C8.2 C15.2 122.3,2.66 v122.68,2.29
HO1
  Top 0.305: 134.62,84.07 134.87,83.82 137.16,83.82 X2.14
  Top 0.61: U2.2 128.27,147.07 129.03,146.3 132.33,146.3 133.6,145.29 133.6,85.09 134.62,84.07
HO2  (via drill 0.8)
  Top 0.813: U4.2 146.3,145.8 | 138.18,141.99 138.18,91.95 141.99,88.14 v141.99,81.28
  Top 1.016: 138.18,141.99 138.18,144.02 139.45,145.29 145.8,145.29 146.3,145.8
  Bottom 0.305: v141.99,81.28 137.16,81.28 X2.11
LO1  (via drill 0.6)
  Top 0.305: 128.27,12.45 128.27,9.4
  Top 0.61: v132.59,83.82 132.59,83.06 130.56,81.03 130.56,16 128.27,13.72 128.27,12.45
  Top 1.016: 128.27,9.4 128.27,6.86 127,5.59 U1.2
  Bottom 0.61: X2.15 133.86,85.09 v132.59,83.82
LO2  (via drill 0.6)
  Top 0.61: v142.24,73.91 142.24,18.29 140.72,16.76 139.95,16.76 | 139.7,5.59 U3.2
  Top 0.813: 139.7,5.59 139.7,5.84 v139.19,6.35 | v138.68,15.49 139.95,16.76
  Bottom 0.61: X2.12 141.48,80.01 141.99,79.5 141.99,74.17 v142.24,73.91
  Bottom 0.813: v139.19,6.35 136.14,6.35 135.38,7.11 135.38,14.22 136.65,15.49 v138.68,15.49
N$1
  Bottom 0.61: U1.5 132.08,13.65 R5.2 C1.2 132.01,18.29 R1.1
N$2
  Bottom 0.61: Q1.4 105.76,7.97 106.93,9.14 117.92,9.14 R2.2
N$3
  Bottom 0.61: R2.1 125.98,8.64 127,9.65 U1.7
N$4  (via drill 0.6)
  Top 0.61: v140.72,13.21 143.76,13.21 144.78,12.19 U3.5
  Bottom 0.61: U3.5 144.78,14.67 R34.2 C2.2 | R31.1 v140.72,13.21
N$5
  Bottom 0.61: R9.2 6.87,13.4 D2.A 7.19,17.1 Q4.G
N$6
  Bottom 0.61: R6.1 130.05,16.32 C1.1 R5.1 130.11,11.75 U1.6
N$7
  Bottom 0.61: R7.2 118.63,13.4 D1.A 118.95,14.56 Q3.G
N$8
  Bottom 0.61: R8.2 121.6,11.36 122.68,12.45 122.68,13.38 D1.C
N$9
  Bottom 0.61: R10.2 10.91,13.4 D2.C
N$10  (via drill 0.6)
  Top 0.813: Q14.4 173.91,9.73 173.23,10.41 167.64,10.41 v166.62,9.4
  Bottom 0.813: v166.62,9.4 R32.2
N$11
  Bottom 0.813: U3.7 139.7,10.67 140.97,9.4 R32.1
N$12  (via drill 0.6)
  Top 0.813: Q2.1 92.1,145.39 90.93,146.56 90.93,148.84 92.2,150.11 103.63,150.11 v104.65,149.1
  Bottom 0.61: C5.1 120.52,148.72 122.17,147.07 126.75,147.07 129.03,143.76 129.03,143.26 130.3,143 130.73,143 D34.C
  Bottom 0.813: C5.1 C6.1 C4.1 109.6,148.72 D49.C v104.65,149.1 | U2.8 D34.C
N$13
  Bottom 0.61: R11.2 18.3,13.4 D3.A 18.62,17.1 Q5.G
N$14
  Bottom 0.61: R12.2 22.34,13.4 D3.C
N$15
  Bottom 0.61: U3.6 142.56,11.5 R34.1 C2.1 R35.1
N$16
  Bottom 0.61: R6.2 128.15,20.51 R14.2
  Bottom 0.813: R13.2 R14.2 127.76,20.07 127,19.3 Q3.S
N$17
  Bottom 0.61: R36.2 150.11,11.18 148.59,12.7 148.59,13.72 | 148.59,13.72 Q15.G | D12.A 148.59,13.72
N$18
  Bottom 0.61: D12.C R37.2
N$19
  Bottom 0.61: R15.2 29.73,13.4 D4.A 30.05,17.1 Q6.G
N$20
  Bottom 0.61: R16.2 33.77,13.4 D4.C
N$21
  Bottom 0.61: R17.2 41.16,13.4 D5.A 41.48,17.1 Q7.G
N$22
  Bottom 0.61: R18.2 45.2,13.4 D5.C
N$23
  Bottom 0.61: D13.A 161.56,13.4 R38.2 160.02,13.65 Q16.G
N$24
  Bottom 0.61: R19.2 51.32,13.4 D6.A 51.64,15.83 Q8.G
N$25
  Bottom 0.61: R20.2 55.36,13.4 D6.C
N$26
  Bottom 0.61: D13.C 166.81,13.97 R39.2
N$27
  Bottom 0.61: R21.2 64.02,13.4 D7.A 64.34,17.1 Q9.G
N$28
  Bottom 0.61: R22.2 68.06,13.4 D7.C
N$29
  Bottom 0.61: R23.2 75.45,13.4 D8.A 75.77,17.1 Q10.G
N$30
  Bottom 0.61: R24.2 79.49,13.4 D8.C
N$32
  Bottom 0.61: R25.2 86.88,13.4 D9.A 87.2,17.1 Q11.G
N$33
  Bottom 0.61: R26.2 90.92,13.4 D9.C
N$34
  Bottom 0.61: R40.2 171.2,13.4 | 171.2,13.4 171.97,13.4 D14.A | Q17.G 171.45,13.65 171.2,13.4
N$35
  Bottom 0.61: R27.2 98.31,13.4 D10.A 98.63,17.1 Q12.G
N$36
  Bottom 0.61: R28.2 102.35,13.4 D10.C
N$37
  Bottom 0.61: R29.2 108.47,13.4 D11.A 108.79,15.83 Q13.G
N$38
  Bottom 0.61: R30.2 112.51,13.4 D11.C
N$39
  Bottom 0.61: R41.2 176.01,13.4 D14.C
N$40
  Bottom 0.61: 151.06,20.32 R42.2 150.94,20.57 145.8,20.57 145.03,19.81 R35.2
  Bottom 0.813: Q15.S R43.2 R42.2
N$41
  Bottom 0.61: D15.A 183.2,13.97 183.04,13.81 | 183.04,13.81 R44.2 | Q18.G 182.88,13.97 183.04,13.81
N$42
  Bottom 0.61: R45.2 188.96,13.4 D15.C
N$43
  Bottom 0.61: R46.2 194.31,13.4 | 194.31,13.4 195.59,13.4 D16.A | Q19.G 194.31,13.4
N$44
  Bottom 0.61: R47.2 199.63,13.4 D16.C
N$45
  Bottom 0.61: D17.A 207.28,13.4 R48.2 Q20.G
N$46
  Bottom 0.61: D17.C 212.53,13.97 R49.2
N$47
  Bottom 0.61: R50.2 216.92,13.4 | 216.92,13.4 217.69,13.4 D18.A | Q21.G 217.17,13.65 216.92,13.4
N$48
  Bottom 0.61: R51.2 221.73,13.4 D18.C
N$49
  Bottom 0.61: Q22.G 228.6,15.49 228.17,15.06 D19.A 227.85,13.4 R52.2
N$50
  Bottom 0.61: R53.2 231.89,13.4 D19.C
N$51
  Bottom 0.61: R54.2 240.55,13.4 D20.A 240.03,13.72 239.78,13.46 239.78,17.27 Q23.G
N$52
  Bottom 0.61: D20.C 246.06,13.72 R55.2
N$53
  Bottom 0.61: R56.2 251.46,13.4 | 251.46,13.4 251.98,13.4 D21.A | Q24.G 251.46,13.4
N$54
  Bottom 0.61: R57.2 256.02,13.4 D21.C
N$55
  Bottom 0.61: R58.2 262.14,13.4 D22.A 262.46,15.06 262.89,15.49 Q25.G
N$56
  Bottom 0.61: R59.2 266.18,13.4 D22.C
N$57
  Bottom 0.813: R3.1 122.87,140.65 U2.5 123.19,143.19 C3.2 R61.2
N$58
  Bottom 0.813: Q2.4 102.01,147.67 102.62,147.07 102.62,144.34 R4.2
N$59  (via drill 0.6)
  Top 0.813: U2.7 128.27,142.24 127,143.51 v107.44,143.51
  Bottom 0.813: R4.1 v107.44,143.51
N$60
  Bottom 0.813: R61.1 C3.1 125.73,143.19 U2.6 R62.1
N$61
  Bottom 0.813: Q26.G 131.57,134.62 | 131.57,134.62 131.9,134.62 D23.A | R63.2 131.83,134.87 131.57,134.62
N$62
  Bottom 0.813: R64.2 136.33,135.14 D23.C
N$63
  Bottom 0.813: Q27.G 118.11,138 D24.A 118.54,140.22 R65.2
N$64
  Bottom 0.813: D24.C 113.35,138.43 R66.2
N$65
  Bottom 0.813: NTC2.1 129.79,72.64 X2.5
N$66
  Bottom 0.813: R67.2 107.43,138.75 D25.A 107.11,136.32 106.68,135.89 Q28.G
N$67
  Bottom 0.813: D25.C 101.92,138.43 R68.2
N$68
  Bottom 0.813: R70.2 R69.2 Q26.S 124.46,136.21 R62.2
N$69
  Bottom 0.813: Q29.G 95.25,135.89 95.68,136.32 D26.A 97.47,138.43 R71.2
N$70
  Bottom 0.813: D26.C 90.49,138.43 R72.2
N$71
  Bottom 0.813: R73.2 84.57,138.75 D27.A 84.25,136.32 83.82,135.89 Q30.G
N$72
  Bottom 0.813: D27.C 79.06,138.43 R74.2
N$73
  Bottom 0.813: R75.2 74.61,138.43 D28.A 72.82,136.32 72.39,135.89 Q31.G
N$74
  Bottom 0.813: R76.2 69.1,138.75 D28.C
N$75
  Bottom 0.813: R77.2 61.71,138.75 D29.A 61.39,136.32 60.96,135.89 Q32.G
N$76
  Bottom 0.813: D29.C 56.2,138.43 R78.2
N$77
  Bottom 0.813: R79.2 50.28,138.75 D30.A 49.96,136.32 49.53,135.89 Q33.G
N$78
  Bottom 0.813: D30.C 44.77,138.43 R80.2
N$79
  Bottom 0.813: R81.2 38.85,138.75 D31.A 38.53,136.32 38.1,135.89 Q34.G
N$80
  Bottom 0.813: D31.C 33.34,138.43 R82.2
N$81
  Bottom 0.813: Q35.G 26.67,135.89 27.1,136.32 D32.A 28.89,138.43 R83.2
N$82
  Bottom 0.813: D32.C 21.91,138.43 R84.2
N$83
  Bottom 0.813: Q36.G 15.67,135.05 D33.A 15.99,138.75 R85.2
N$84
  Bottom 0.813: R86.2 12.27,138.75 D33.C
N$86
  Bottom 0.61: R88.1 R90.2 C10.2 139.45,138.18 140.97,141.22 U4.5
N$87
  Bottom 0.813: R89.2 176.78,149.35 177.55,148.59 177.55,147.85 Q37.4
N$88  (via drill 0.6)
  Top 0.813: U4.7 146.56,142.24 148.08,143.76 150.88,143.51 156.72,149.35 v157.73,149.35
  Bottom 1.016: v157.73,149.35 R89.1
N$89
  Bottom 0.61: R90.1 C10.1 142.24,138.18 | 142.24,138.18 R91.1 | 144.27,140.97 142.75,138.68 142.24,138.18
  Bottom 0.813: 144.27,140.97 U4.6
N$90
  Bottom 0.813: Q38.G 153.67,137.92 154.18,138.43 153.67,138.43 | 153.67,138.43 153.59,138.43 D35.A | R92.2 153.74,138.5 153.67,138.43
N$91
  Bottom 0.813: D35.C 150.56,139.45 R93.2
N$92
  Bottom 0.813: Q39.G 165.1,137.73 R94.2 163.94,138.5 D36.A
N$93
  Bottom 0.813: R95.2 160.16,138.5 D36.C
N$95
  Bottom 0.813: Q40.G 176.53,137.84 | 176.53,137.84 D37.A | 176.53,137.84 176.71,137.84 177.29,138.43 177.99,138.43 R96.2
N$96
  Bottom 0.813: R97.2 172.1,138.5 D37.C
N$97
  Bottom 0.813: R91.2 146.24,137.48 Q38.S 148.59,132.27 148.08,131.76 | R98.2 148.08,131.76 | 148.08,131.76 R99.2
N$98
  Bottom 0.813: Q41.G 187.96,137.99 R100.2 186.55,138.5 D38.A
N$99
  Bottom 0.813: R101.2 182.77,138.5 D38.C
N$100
  Bottom 0.813: D39.A 199.71,138.94 R102.2 199.39,138.24 Q42.G
N$101
  Bottom 0.813: R103.2 194.2,138.5 D39.C
N$102
  Bottom 0.813: Q43.G 210.82,137.99 R104.2 209.41,138.5 D40.A
N$103
  Bottom 0.813: D40.C 204.15,138.68 R105.2
N$104
  Bottom 0.813: D41.A 222.5,138.68 | 222.5,138.68 223.08,138.68 R106.2 | Q44.G 222.25,138.43 222.5,138.68
N$105
  Bottom 0.813: R107.2 217.57,138.5 D41.C
N$106
  Bottom 0.813: Q45.G 233.68,138.43 | 233.68,138.43 233.35,138.43 D42.A | R108.2 233.75,138.5 233.68,138.43
N$107
  Bottom 0.813: R109.2 229,138.5 D42.C
N$108
  Bottom 0.813: D43.A 245.36,138.68 | 245.36,138.68 245.68,138.68 R110.2 | Q46.G 245.11,138.43 245.36,138.68
N$109
  Bottom 0.813: D43.C 238.69,138.68 R111.2
N$110
  Bottom 0.813: D44.A 256.29,138.68 | 256.29,138.68 257.37,138.68 R112.2 | Q47.G 256.54,138.43 256.29,138.68
N$111
  Bottom 0.813: R113.2 251.98,138.75 D44.C
N$112
  Bottom 0.813: Q48.G 267.97,138.35 D45.A 269.68,138.68 R114.2
N$113
  Bottom 0.813: R115.2 264.05,138.5 D45.C
N$115
  Bottom 0.813: U4.8 149.1,143.33 D46.C 149.68,143.59 151.89,147.07 D50.C | 160.41,147.06 C13.1 | C11.1 170.2,146.69 Q37.1
  Bottom 1.016: D50.C 160.41,147.06 | C13.1 C12.1 C11.1
N$118
  Top 1.27: R117.2 C24.2
N$119
  Top 1.27: R118.2 C25.1
N$120
  Top 1.016: R119.2 C22.2
N$121
  Top 1.016: R120.2 C23.1
N$150
  Bottom 0.61: 170.69,11.18 170.18,11.18 R40.1 | 267.65,11.18 R59.1 | R58.1 260.35,11.43 260.6,11.18 | R57.1 257.81,11.18 | R56.1 250.38,11.5 250.7,11.18 | R55.1 246.38,11.18 | R45.1 190.5,11.18 | R46.1 193.8,11.18 | R47.1 201.17,11.18 | R48.1 205.74,11.43 205.49,11.18 | R53.1 233.68,11.18 | R52.1 226.06,11.18 | R51.1 223.52,11.18 | R44.1 182.63,11.18 | 177.8,11.18 R41.1 177.8,11.68 | R39.1 167.39,11.18 | R38.1 159.77,11.18 | R37.1 155.45,11.43 155.7,11.18 | R50.1 215.9,11.18 | R49.1 213.11,11.43 213.36,11.18 | 238.76,11.18 239.01,11.18 238.76,11.43 R54.1 238.76,11.18 | 236.54,11.18 R60.2 236.22,11.18 236.54,11.18
  Bottom 0.813: 170.51,11 170.69,11.18
  Bottom 1.016: R36.1 155.7,11.18 159.77,11.18 167.39,11.18 170.18,11.18 | 170.69,11.18 177.8,11.18 182.63,11.18 190.5,11.18 193.8,11.18 201.17,11.18 205.49,11.18 213.36,11.18 215.9,11.18 223.52,11.18 226.06,11.18 233.68,11.18 236.22,11.18 | 239.01,11.18 246.38,11.18 250.7,11.18 257.81,11.18 260.6,11.18 267.65,11.18 | 238.76,11.18 236.54,11.18 | Q14.2 170.51,11
N$160
  Bottom 0.61: 5.4,11.18 R9.1 | R10.1 12.7,11.18 | R11.1 16.51,11.43 16.26,11.18 | R12.1 24.13,11.18 | R15.1 27.94,11.43 27.69,11.18 | R16.1 35.56,11.18 | R17.1 39.37,11.18 | R18.1 46.99,11.18 | R19.1 49.53,11.43 49.78,11.18 | R20.1 57.15,11.18 | R33.2 59.69,11.18 | R21.1 62.23,11.43 62.48,11.18 | R22.1 69.85,11.43 70.1,11.18 | R23.1 73.66,11.18 | R24.1 81.28,11.43 81.53,11.18 | R25.1 85.09,11.43 85.34,11.18 | R28.1 104.14,11.18 | R29.1 106.68,11.43 106.93,11.18 | 96.52,11.18 92.71,11.18 R26.1 R27.1 96.52,11.18
  Bottom 0.813: 101.42,11 101.6,11.18 | R30.1 114.3,11.18 | R7.1 116.84,11.43 117.09,11.18
  Bottom 1.016: R8.1 117.09,11.18 114.3,11.18 106.93,11.18 104.14,11.18 101.6,11.18 96.52,11.18 | 92.71,11.18 85.34,11.18 81.53,11.18 73.66,11.18 70.1,11.18 62.48,11.18 59.69,11.18 57.15,11.18 49.78,11.18 46.99,11.18 39.37,11.18 35.56,11.18 27.69,11.18 24.13,11.18 16.26,11.18 12.7,11.18 5.4,11.18 | Q1.2 101.42,11
N$170  (via drill 0.6)
  Top 0.813: Q37.2 170.28,147.42 168.15,145.29 v168.15,140.4
  Bottom 0.813: R93.1 R92.1 R95.1 R94.1 v168.15,140.4 R97.1 R96.1 R101.1 R100.1 R103.1 199.64,140.4 R102.1 203.45,140.65 R105.1 R104.1 R107.1 R106.1 R109.1 227.77,140.4 228.09,140.72 234.63,140.72 R108.1 235.14,140.4 235.46,140.72 238.19,140.72 R111.1 238.95,140.4 239.27,140.72 245.55,140.72 R110.1 246.13,140.65 R113.1 250.19,140.4 R112.1 R116.2 R115.1 262.38,140.65 R114.1
N$180  (via drill 0.6)
  Top 0.813: v128.27,138.43 116.84,138.43 v114.81,140.97
  Bottom 0.813: R65.1 v114.81,140.97 | v114.81,140.97 113.35,140.97 R66.1 R67.1 R68.1 R71.1 R72.1 89.66,140.65 | v114.81,140.97 113.03,140.97 | R86.1 R85.1 R84.1 R83.1 R82.1 R81.1 R80.1 R79.1 R78.1 R77.1 R87.2 R76.1 R75.1 R74.1 R73.1 89.66,140.65 | v128.27,138.43 131.76,138.43 R63.1 134.37,138.36 R64.1 | Q2.2 91.03,147.67 89.66,146.3 89.66,140.65
NTC1
  Bottom 0.406: X2.6 138.18,72.39 136.91,73.66 134.11,73.66 131.83,76.2 NTC2.2
OUT1  (via drill 0.6, 0.8)
  Top 0.813: v123.19,129.54 123.19,128.27 | v121.92,135.89 121.92,134.62 | Q29.S 90.17,137.67 91.69,139.19 93.98,139.19 95.5,140.72 Q2.3 | C22.1 88.52,8
  Top 1.016: 88.52,8 90.17,9.65 Q11.D
  Top 1.27: R117.1 43.18,135.13 43.94,134.37
  Bottom 0.813: Q31.S 67.31,135.89 66.04,137.16 R87.1 | R70.1 122.87,129.86 v123.19,129.54 123.51,129.86 R69.1 | v121.92,135.89 120.97,136.84 R3.2 120.9,144.85 C5.2 C6.2 C4.2 111.12,145.92 110.49,145.29 109.48,145.29 D49.A | D51.C 119.13,78.23 v119.38,79.25 D53.A
  other vias: 111.51,135.38 111.51,133.86 100.08,133.86 100.08,135.38 88.65,133.86 88.65,135.38 77.22,135.38 77.22,133.86 65.79,135.38 65.79,133.86 54.36,135.38 54.36,133.86 42.93,135.38 42.93,133.86 31.5,135.38 31.5,133.86 20.07,135.38 20.07,133.86 8.64,135.38 8.64,133.86
  pour Top (isolate 1.27, no thermals): 1.27,135.89 129.54,135.89 129.54,16.26 1.27,16.26
OUT2  (via drill 0.6, 0.8)
  Top 0.813: v148.08,128.78 148.08,127.51 147.83,126.49 147.83,79.5 v149.1,79.25 | Q39.S 160.02,141.48 v160.53,141.99
  Top 1.016: C23.2 183.39,7.62 185.42,9.65 Q18.D
  Top 1.27: R118.1 184.4,144.53 182.88,143 Q41.S | v146.3,67.31 147.07,67.31 147.32,67.56 | 196.98,17.4 Q19.D
  Bottom 0.61: R88.2 141.73,133.6 145.54,129.79 147,129.79 R98.1
  Bottom 0.813: R98.1 147.07,129.79 v148.08,128.78 149.16,129.86 R99.1 | Q37.3 176.28,143.26 | 168.53,143.26 C11.2 | 159.89,143.89 C13.2 160.53,143.63 v160.53,141.99 | 156.98,143 D50.A | D52.C | R116.1 259.84,137.67 261.11,136.4 261.11,135.64 v261.37,135.38
  Bottom 1.016: 176.28,143.26 175.01,141.99 171.2,141.99 169.93,143.26 168.53,143.26 | C11.2 C12.2 C13.2 | 159.89,143.89 159,143 156.98,143
  Bottom 1.27: v149.1,79.25 D52.C | D54.A v146.3,67.31
  other vias: 238.51,135.38 238.51,133.86 249.94,135.38 249.94,133.86 227.08,135.38 227.08,133.86 215.65,135.38 215.65,133.86 204.22,135.38 204.22,133.86 261.37,133.86 192.79,135.38 192.79,133.86 181.36,135.38 181.36,133.86 169.93,135.38 169.93,133.86 158.5,135.38 158.5,133.86
  pour Top (isolate 1.27, no thermals): 145.29,136.91 271.02,136.91 271.02,15.49 145.03,15.49 145.03,137.16
VCC  (via drill 0.6)  (1 unrouted)
  Top 0.61: 137.16,60.96 140.21,64.01 140.21,74.93
  Top 0.813: X2.7 X2.8 140.21,74.93 141.22,74.93 143.51,77.22 143.51,136.91
  Top 1.016: U3.1 U3.8 137.16,60.96 | U1.1 U1.8 | 143.51,136.91 143.51,137.16 142.49,138.18 141.22,138.18 139.7,139.7 139.7,142.75 139.95,143 v145.03,143
  Bottom 0.813: C9.1 146.3,145.8 | 148.77,147.07 D46.A | 148.77,148.51 U4.1 149.1,149.61 | 130.81,148.84 U2.1 D34.A 131.02,148.51 C14.1 | 146.81,1.78 147.7,2.92 C16.1 166.9,2.92 Q14.1 | U3.1 137.16,3.05 135.89,1.78 125.48,1.52 | U1.1 124.46,2.54 | 124.97,2.29 125.22,2.03
  Bottom 1.016: 146.3,145.8 147.57,147.07 148.77,147.07 148.77,148.51 | 130.81,148.84 132.08,150.37 148.59,150.37 149.1,149.61 | 146.81,1.78 138.18,1.78 137.16,3.05 | 124.46,2.54 124.97,2.29 | 125.22,2.03 125.48,1.52 | Q1.1 99.72,4.17 102.11,1.78 108.71,1.78 110.24,3.3 110.24,4.06 D47.C 115.7,6.35 C8.1 C15.1 122.55,5.46 U1.1 | v145.03,143 145.03,143.51 145.8,144.27 145.8,145.67 C9.1
VCC/2  (via drill 0.6)
  Top 0.61: v135.64,63.25 135.64,67.06 X2.1
  Top 0.813: v133.6,76.96 133.6,68.58 X2.1 X2.2
  Top 1.27: C25.2 229.36,144.53 230.89,143 230.89,134.87 Q45.D | Q30.D 81.28,142.75 83.06,144.53 85.22,144.53 C24.1
  Bottom 0.61: D48.C v135.64,63.25
  Bottom 0.813: D53.C 108.46,86.61 107.44,87.63 | v133.6,76.96 133.6,77.72 133.35,78.49
  Bottom 1.27: X2.2 D54.C
  pour Bottom (isolate 1.27, no thermals): 1.27,137.16 271.78,137.16 271.78,76.2 1.27,76.2
(copper drawn outside any net)
  shapes: Bottom area x22